# EAGLE design GRBL-Teknic (EAGLE 8.0.1)
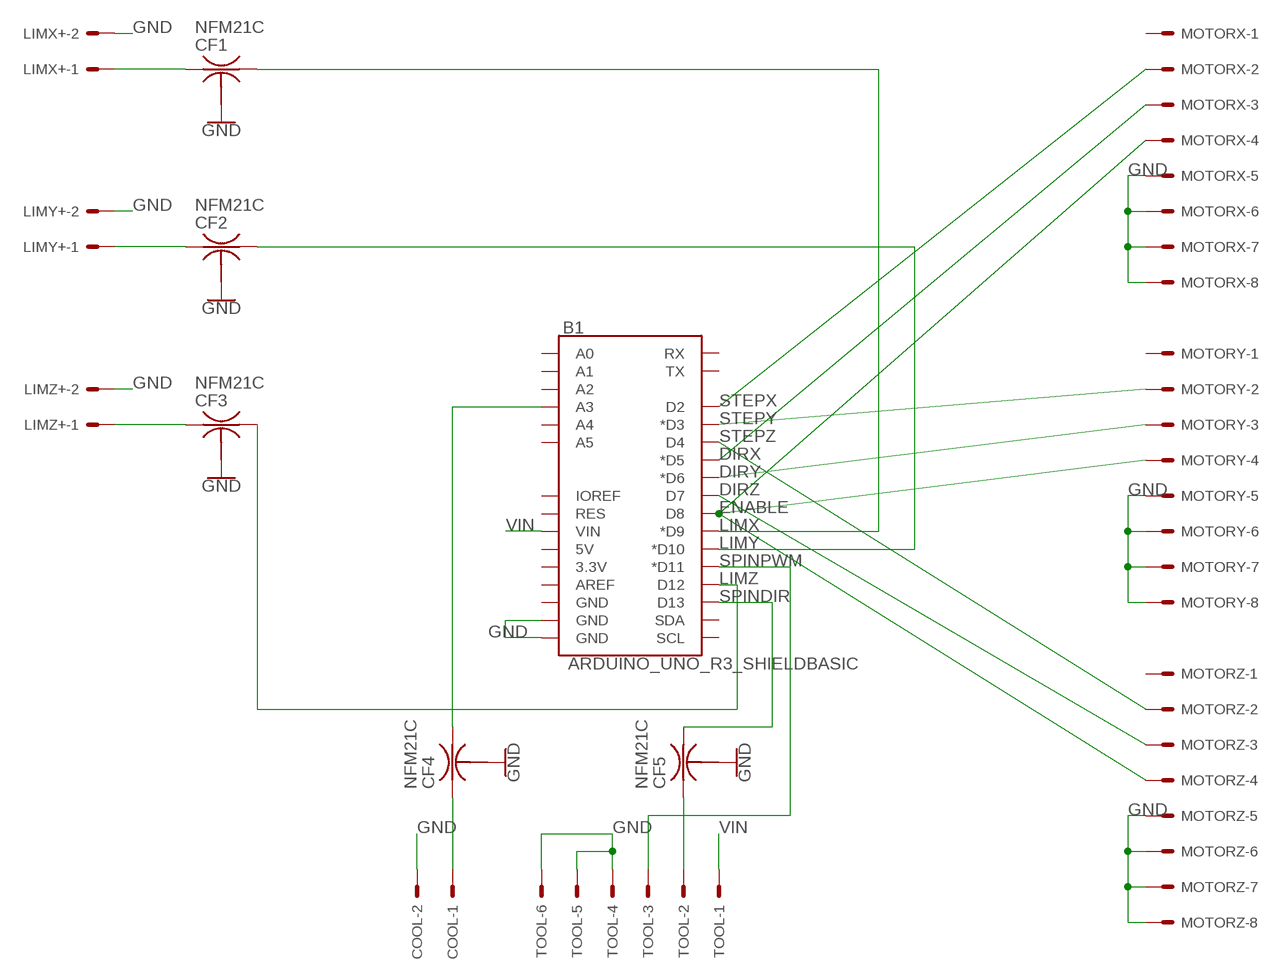
[diagram p0: schematic, sheet 1]

## Parts
B1  ARDUINO_UNO_R3_SHIELDBASIC  [UNO_R3_SHIELD]
CF1  NFM21C  [NFM21C]
CF2  NFM21C  [NFM21C]
CF3  NFM21C  [NFM21C]
CF4  NFM21C  [NFM21C]
CF5  NFM21C  [NFM21C]
COOL  555X-2V  [5566-2]
LIMX+  555X-2V  [5566-2]
LIMY+  555X-2V  [5566-2]
LIMZ+  555X-2V  [5566-2]
MOTORX  555X-8V  [5566-8]
MOTORY  555X-8V  [5566-8]
MOTORZ  555X-8V  [5566-8]
TOOL  555X-6V  [5566-6]

## Nets
COOL: B1.A3 CF4.3
DIRX: B1.D5(*D5) MOTORX.3
DIRY: B1.D6(*D6) MOTORY.3
DIRZ: B1.D7 MOTORZ.3
ENABLE: B1.D8 MOTORX.4 MOTORY.4 MOTORZ.4
GND: B1.GND@0(GND) B1.GND@1(GND) CF1.2@1 CF2.2@1 CF3.2@1 CF4.2@1 CF5.2@1 COOL.2 LIMX+.2 LIMY+.2 LIMZ+.2 MOTORX.5 MOTORX.6 MOTORX.7 MOTORX.8 MOTORY.5 MOTORY.6 MOTORY.7 MOTORY.8 MOTORZ.5 MOTORZ.6 MOTORZ.7 MOTORZ.8 TOOL.4 TOOL.5 TOOL.6
LIMX: B1.D9(*D9) CF1.3
LIMY: B1.D10(*D10) CF2.3
LIMZ: B1.D12 CF3.3
N$1: CF4.1 COOL.1
N$2: CF5.1 TOOL.2
N$3: CF1.1 LIMX+.1
N$4: CF2.1 LIMY+.1
N$5: CF3.1 LIMZ+.1
SPINDIR: B1.D13 CF5.3
SPINPWM: B1.D11(*D11) TOOL.3
STEPX: B1.D2 MOTORX.2
STEPY: B1.D3(*D3) MOTORY.2
STEPZ: B1.D4 MOTORZ.2
VIN: B1.VIN TOOL.1
Unconnected: B1.3.3V B1.5V B1.A0 B1.A1 B1.A2 B1.A4 B1.A5 B1.AREF B1.GND@2(GND) B1.IOREF B1.RES B1.RX B1.SCL B1.SDA B1.TX CF1.2@2 CF2.2@2 CF3.2@2 CF4.2@2 CF5.2@2 MOTORX.1 MOTORY.1 MOTORZ.1

## Library data of the parts
B1 = SparkFun-Boards:ARDUINO_UNO_R3_SHIELD: Arduino R3 Shield Footprint Shield form compatible with the Arduino Uno R3. SparkFun Products: MG2639 Cellular Shield <https://www.sparkfun.com/products/13120> MIDI Shield <https://www.sparkfun.com/products/12898> R3 Stackable Headers Kit <https://www.sparkfun.com/products/11417>
CF1-CF5 = murata-filter:NFM: EMIFIL(R) (Capacitor type) Single Circuit Type for Signal Lines Source: http://search.murata.co.jp/Ceramy/image/img/PDF/ENG/L0111S0109NFM3DC.pdf; MPN: NFM21CC102R1H3D; OC_FARNELL: 1828795; OC_NEWARK: 84R0165
COOL LIMX+ LIMY+ LIMZ+ = con-molex-2:555X-2: Mini FIT connector 2 way
MOTORX MOTORY MOTORZ = con-molex-2:555X-8: Mini FIT connector 8 way
TOOL = con-molex-2:555X-6: Mini FIT connector 6 way

## Board
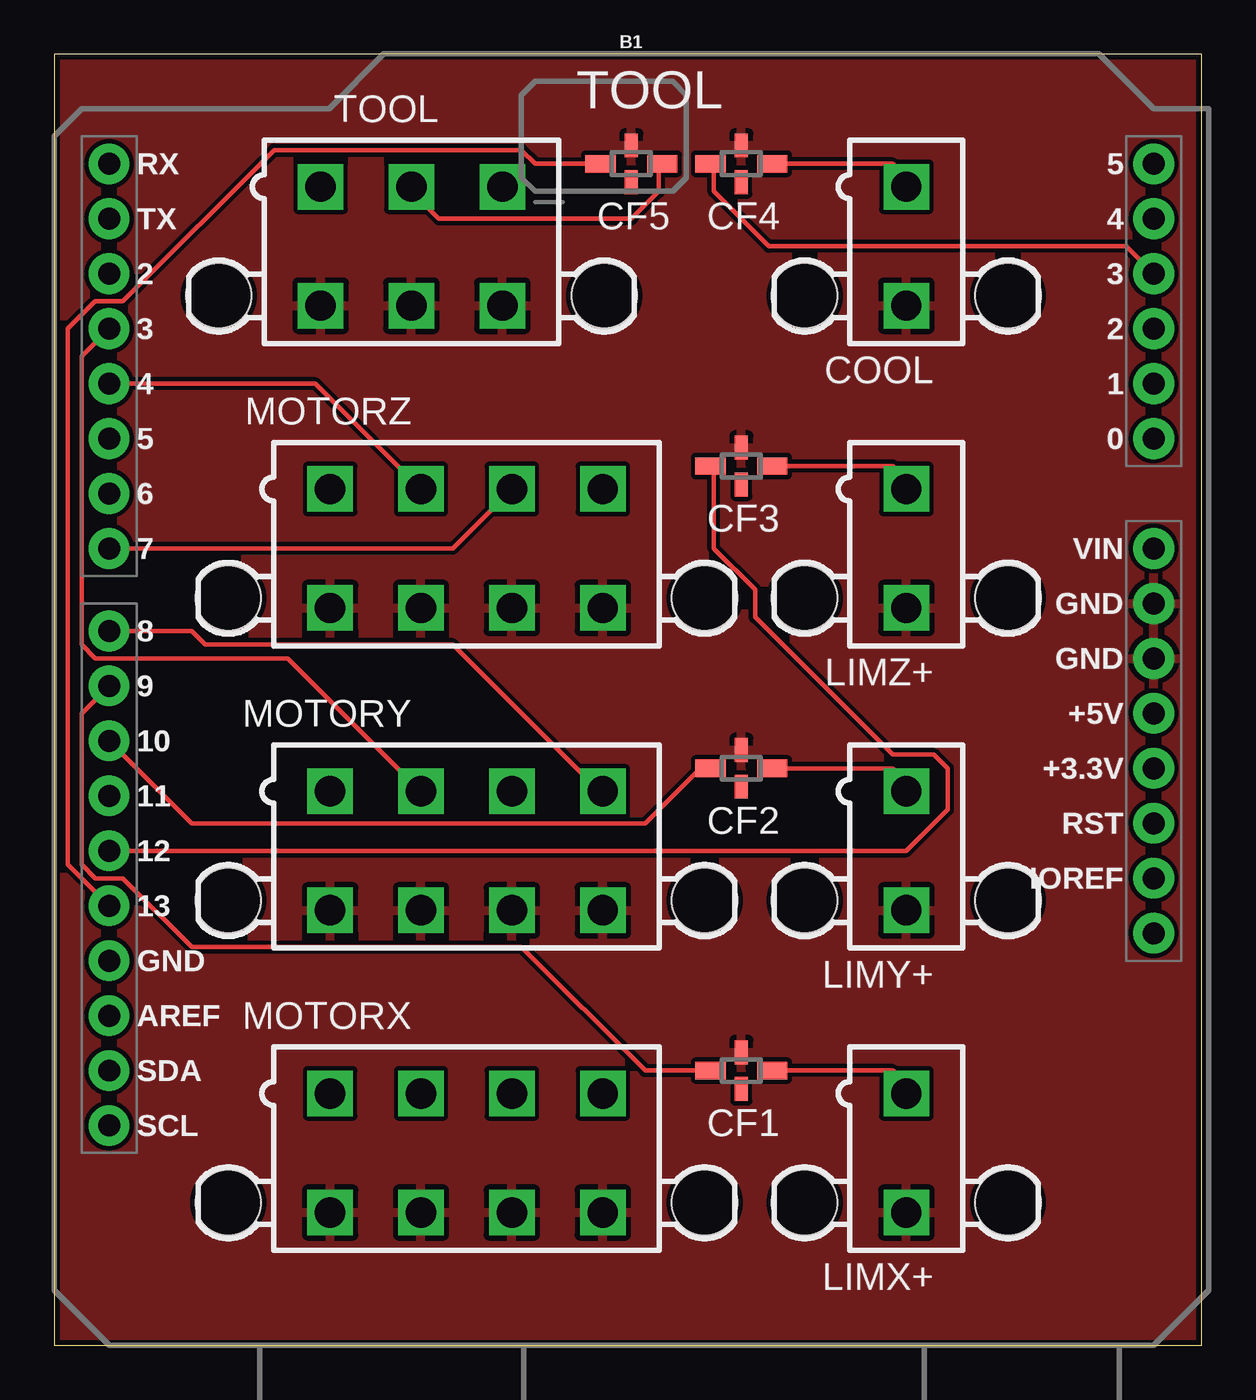
[diagram p1: board, top side]
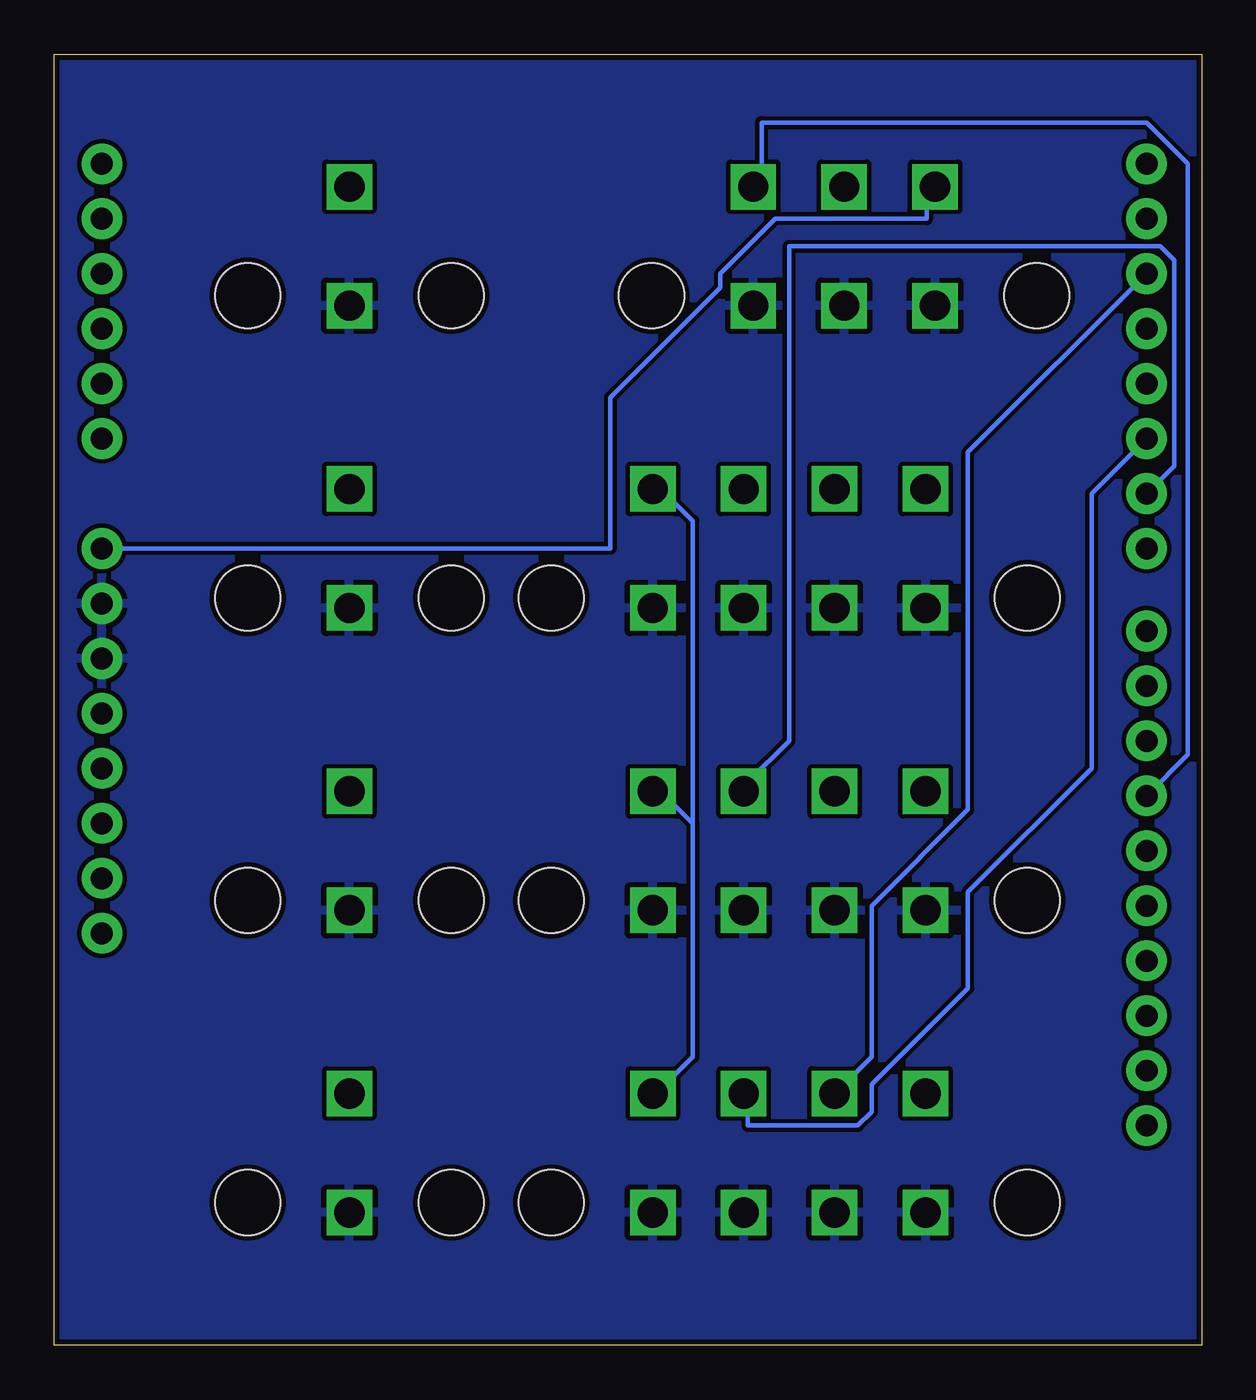
[diagram p2: board, bottom side, seen from below]

Size 53.01 x 59.68 mm. Coordinates in mm from the lower left corner, seen from the top.
Outline: 0,0 53.01,0 53.01,59.68 0,59.68 0,0
Copper layers (1*16): Top 0.035mm / dielectric 1.5mm / Bottom 0.035mm
Design rules "SparkFun": minimum track width 8mil, minimum drill 20mil, track to track 8mil, track to pad 8mil, pad to pad 8mil, via to via 8mil, smd to smd 8mil, copper to edge 10mil, drill to drill 8mil, minimum pad ring 12mil, minimum via ring 10mil, stop-mask expansion 4mil, vias tented up to drill 25mil, thermal gap 10mil

### Footprints (pad centres in the part's own frame; a part is rotated, then mirrored left to right if it is on the bottom)
UNO_R3_SHIELD = drill 1.016 pad 1.88: 3.3V 24.13,-2.54; 5V 24.13,0; A0 24.13,12.7; A1 24.13,15.24; A2 24.13,17.78; A3 24.13,20.32; A4 24.13,22.86; A5 24.13,25.4; AREF -24.13,-13.97; D2 -24.13,20.32; D3 -24.13,17.78; D4 -24.13,15.24; D5 -24.13,12.7; D6 -24.13,10.16; D7 -24.13,7.62; D8 -24.13,3.81; D9 -24.13,1.27; D10 -24.13,-1.27; D11 -24.13,-3.81; D12 -24.13,-6.35; D13 -24.13,-8.89; GND@0 24.13,2.54; GND@1 24.13,5.08; GND@2 -24.13,-11.43; IOREF 24.13,-7.62; NC 24.13,-10.16; RES 24.13,-5.08; RX -24.13,25.4; SCL -24.13,-19.05; SDA -24.13,-16.51; TX -24.13,22.86; VIN 24.13,7.62
NFM21C = smd 1.4 x 0.8: 1 -1.425,0; 3 1.425,0 | smd 0.6 x 1.1: 2@1 0,-0.85; 2@2 0,0.85
5566-2 = drill 1.4 square: 1 0,-2.75; 2 0,2.75 | hole 3: 4.7,2.29; -4.7,2.29
5566-8 = drill 1.4 square: 1 6.3,-2.75; 2 2.1,-2.75; 3 -2.1,-2.75; 4 -6.3,-2.75; 5 6.3,2.75; 6 2.1,2.75; 7 -2.1,2.75; 8 -6.3,2.75 | hole 3: 11,2.29; -11,2.29
5566-6 = drill 1.4 square: 1 4.2,-2.75; 2 0,-2.75; 3 -4.2,-2.75; 4 4.2,2.75; 5 0,2.75; 6 -4.2,2.75 | hole 3: 8.9,2.29; -8.9,2.29

### Placement (x,y rotation side)
B1  26.67,29.21 0 top
CF1  31.75,12.7 180 top
CF2  31.75,26.67 180 top
CF3  31.75,40.64 180 top
CF4  31.75,54.61 180 top
CF5  26.67,54.61 180 top
COOL  39.37,50.8 180 top
LIMX+  39.37,8.89 180 top
LIMY+  39.37,22.86 180 top
LIMZ+  39.37,36.83 180 top
MOTORX  19.05,8.89 180 top
MOTORY  19.05,22.86 180 top
MOTORZ  19.05,36.83 180 top
TOOL  16.51,50.8 180 top

### Tracks (layer width: path | path; a pad name or v marks a point on that pad's centre or on a via)
COOL
  Top 0.203: B1.A3 49.53,50.8 33.02,50.8 30.48,53.34 30.48,54.61 CF4.3
DIRX
  Bottom 0.203: B1.D5 5.08,39.37 5.08,26.67 10.79,20.95 10.79,16.51 15.24,12.06 15.24,10.79 15.88,10.16 20.95,10.16 20.95,11.43 MOTORX.3
DIRY
  Bottom 0.203: B1.D6 1.27,40.64 1.27,50.16 1.91,50.8 19.05,50.8 19.05,27.94 20.95,26.04 MOTORY.3
DIRZ
  Top 0.203: B1.D7 18.41,36.83 20.95,39.37 MOTORZ.3
ENABLE
  Top 0.203: B1.D8 6.35,33.02 6.99,32.38 18.41,32.38 24.77,26.04 MOTORY.4
  Bottom 0.203: 23.5,24.13 23.5,13.34 24.77,12.06 MOTORX.4 | 23.5,24.13 24.77,25.4 MOTORY.4 | 23.5,24.13 23.5,38.1 24.77,39.37 MOTORZ.4
GND
  pour Bottom: 0,59.69 0,0 53.34,0 53.34,59.69
  pour Top: 0,59.69 53.34,59.69 53.34,0 0,0
LIMX
  Top 0.203: CF1.3 27.3,12.7 21.59,18.41 6.35,18.41 3.17,21.59 1.91,21.59 1.27,22.23 1.27,29.21 B1.D9
LIMY
  Top 0.203: B1.D10 6.35,24.13 27.3,24.13 29.84,26.67 CF2.3
LIMZ
  Top 0.203: B1.D12 39.37,22.86 41.27,24.77 41.27,26.67 40.64,27.3 38.73,27.3 32.38,33.66 32.38,34.92 30.48,36.83 30.48,40.64 CF3.3
N$1
  Top 0.203: CF4.1 38.73,54.61 39.37,53.98 COOL.1
N$2
  Top 0.203: CF5.1 27.94,54.61 27.94,53.34 26.67,52.07 17.78,52.07 16.51,53.34 TOOL.2
N$3
  Top 0.203: CF1.1 38.73,12.7 39.37,12.06 LIMX+.1
N$4
  Top 0.203: CF2.1 38.73,26.67 39.37,26.04 LIMY+.1
N$5
  Top 0.203: CF3.1 38.73,40.64 39.37,40.01 LIMZ+.1
SPINDIR
  Top 0.203: CF5.3 22.23,54.61 21.59,55.24 10.16,55.24 3.17,48.26 1.91,48.26 0.64,46.99 0.64,22.23 B1.D13
SPINPWM
  Bottom 0.203: B1.D11 0.64,27.3 0.64,54.61 2.54,56.52 20.32,56.52 20.32,53.98 TOOL.3
STEPX
  Bottom 0.203: B1.D2 10.79,41.27 10.79,24.77 15.24,20.32 15.24,13.34 16.51,12.06 MOTORX.2
STEPY
  Top 0.203: B1.D3 1.27,45.72 1.27,32.38 1.91,31.75 10.79,31.75 16.51,26.04 MOTORY.2
STEPZ
  Top 0.203: B1.D4 12.06,44.45 16.51,40.01 MOTORZ.2
VIN
  Bottom 0.203: B1.VIN 27.3,36.83 27.3,43.81 22.23,48.9 22.23,49.53 19.68,52.07 12.7,52.07 12.7,53.34 TOOL.1

### Text on the board
tPlace: TOOL